# EasyEDA schematic Sha_ExtruderDriver-03.json
TITLE: Sheet_1; REV: 1.0; Date: 2024-12-03; Sheet: 1/1; Company: Your Company
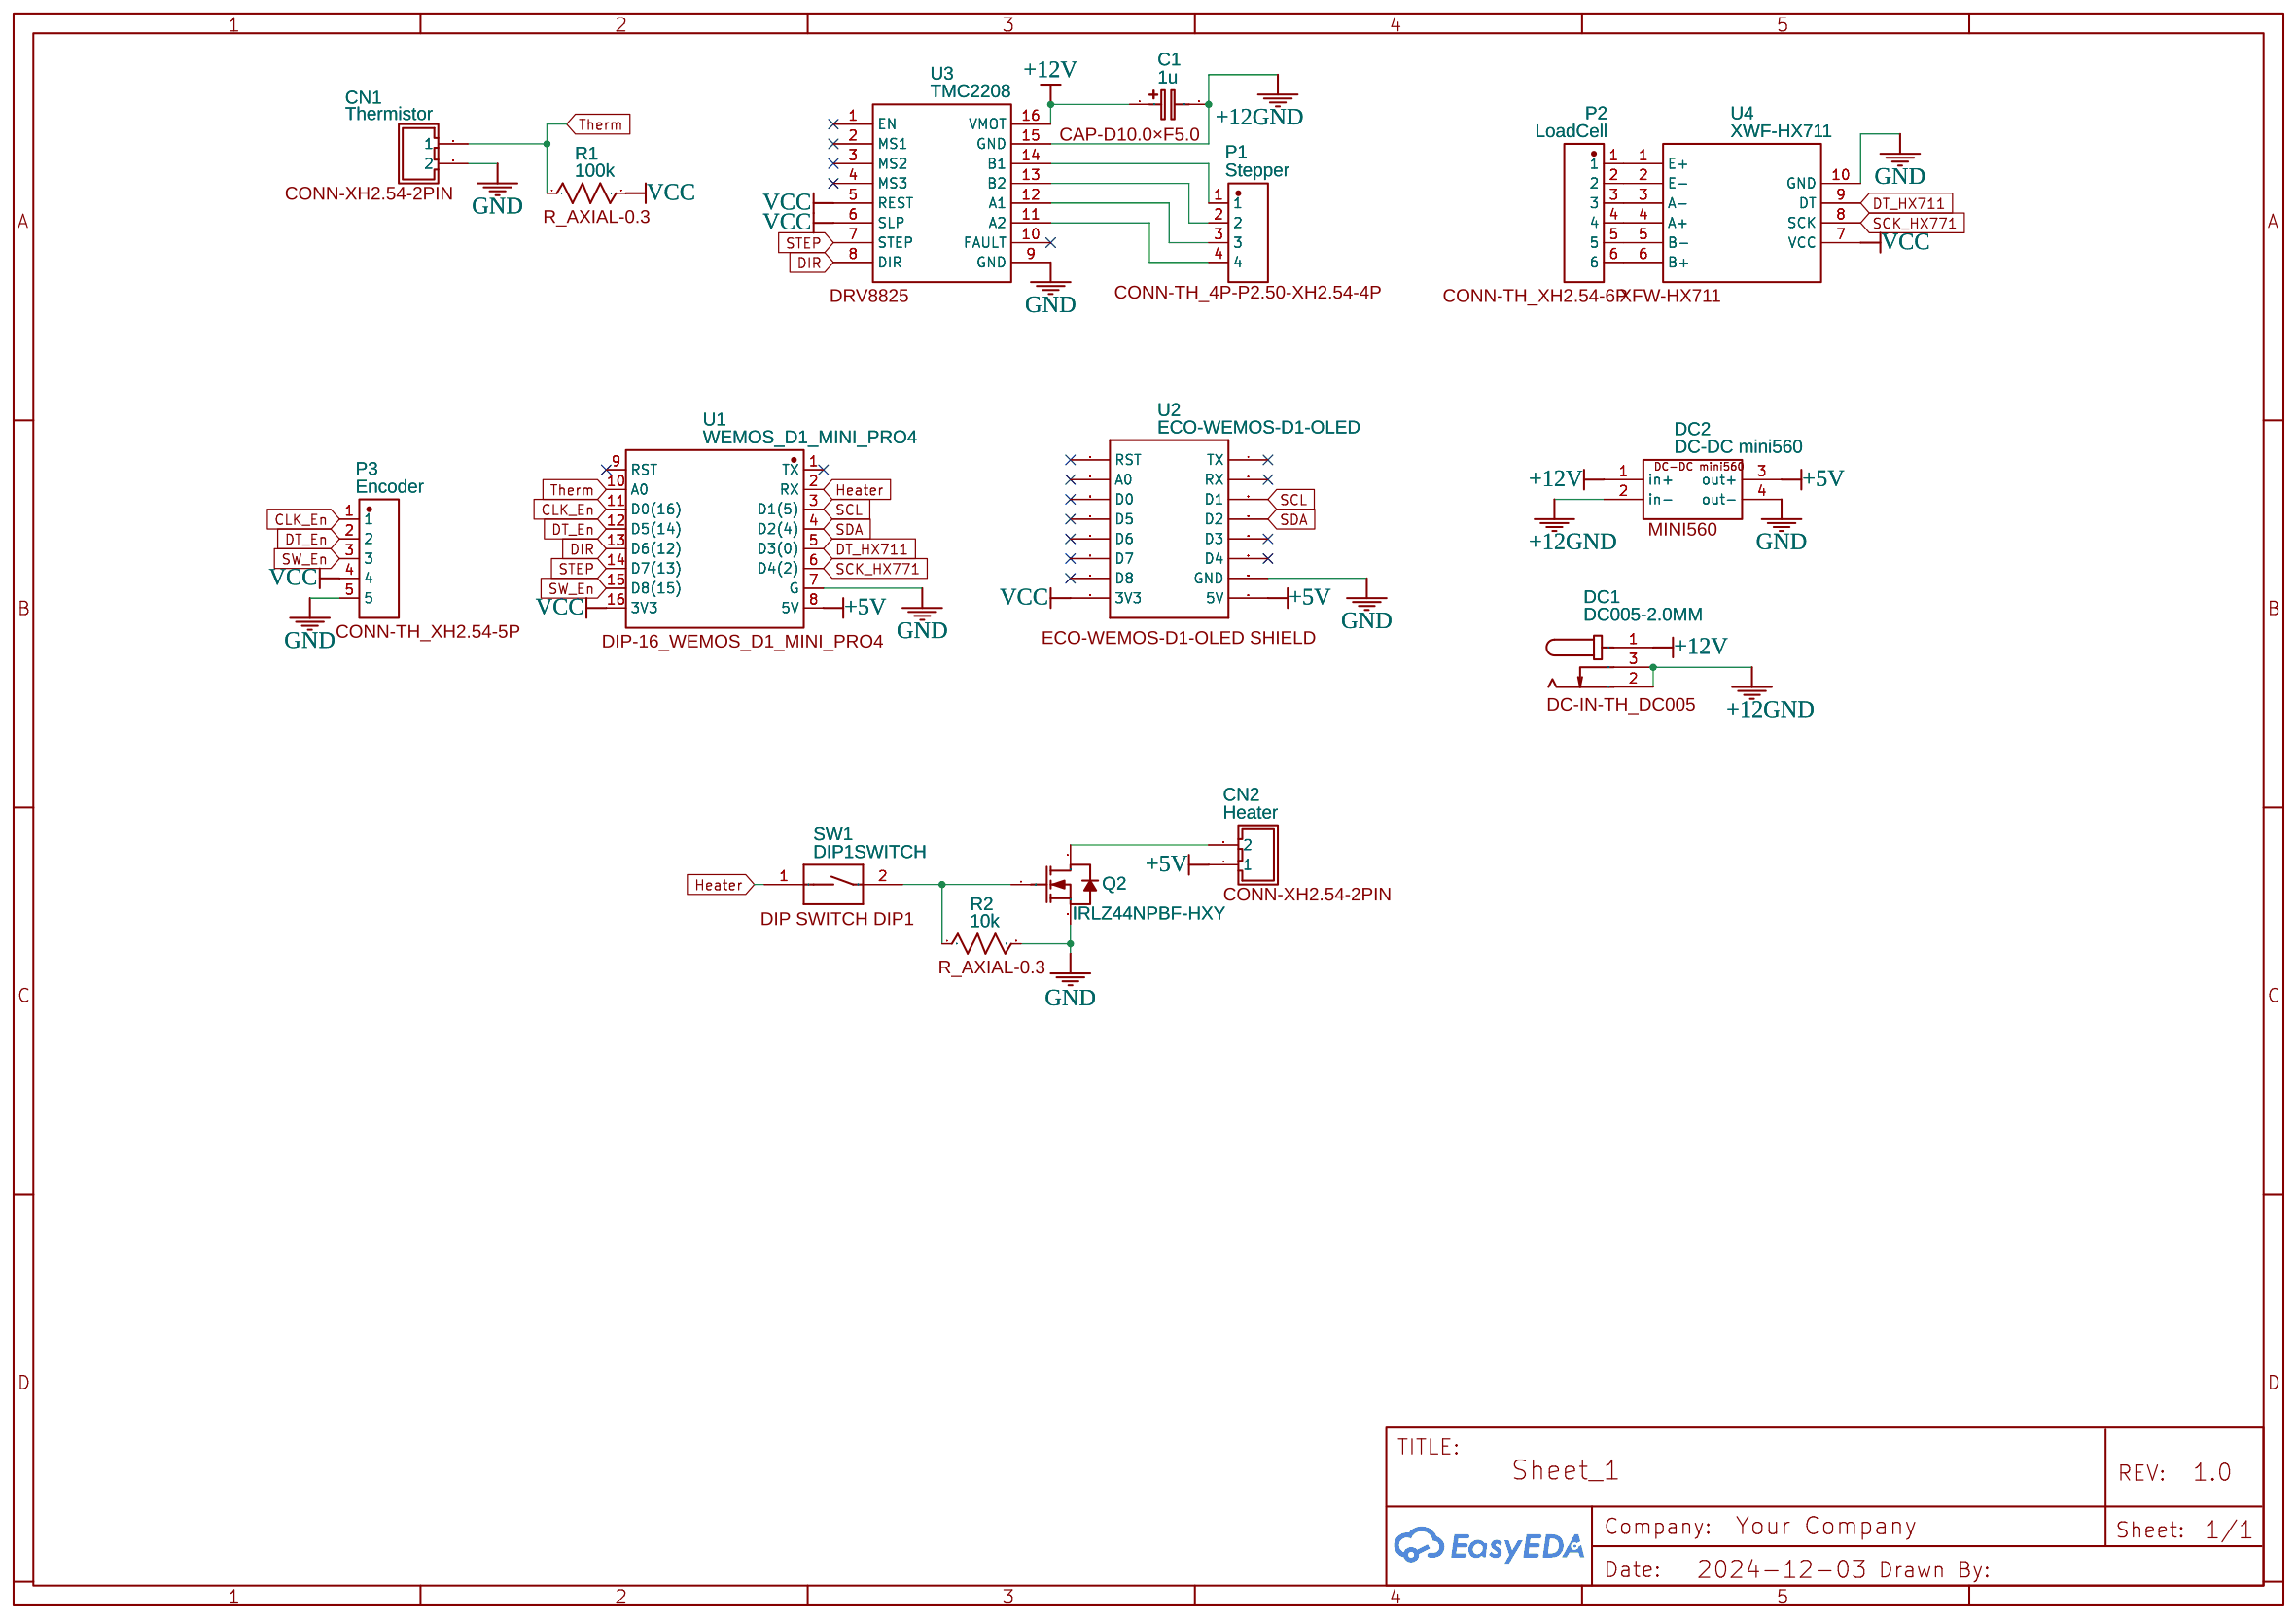
[diagram p0: schematic sheet]

## Parts
C1  1u  [CAP-D10.0×F5.0]
CN1  Thermistor  [CONN-XH2.54-2PIN]
CN2  Heater  [CONN-XH2.54-2PIN]
DC1  DC005-2.0MM  [DC-IN-TH_DC005]
DC2  DC-DC mini560  [MINI560]
P1  Stepper  [CONN-TH_4P-P2.50-XH2.54-4P]
P2  LoadCell  [CONN-TH_XH2.54-6P]
P3  Encoder  [CONN-TH_XH2.54-5P]
Q2  IRLZ44NPBF-HXY  [TO-220-3_L9.9-W4.5-P2.54-L-1]
R1  100k  [R_AXIAL-0.3]
R2  10k  [R_AXIAL-0.3]
SW1  DIP1SWITCH  [DIP SWITCH DIP1]
U1  WEMOS_D1_MINI_PRO4  [DIP-16_WEMOS_D1_MINI_PRO4]
U2  ECO-WEMOS-D1-OLED  [ECO-WEMOS-D1-OLED SHIELD]
U3  TMC2208  [DRV8825]
U4  XWF-HX711  [XFW-HX711]

## Library data of the parts
C1 = CE_TH_D10.0×F5.0_EU: Contributor: LCEDA_Lib; Package Display: Yes
CN1 CN2 = XH2.54-2PIN: Contributor: ahmedyerli; Package Display: Yes
DC1 = DC005-2.0MM: Supplier: LCSC; Manufacturer: SOFNG; Supplier Part: C111567; Package Display: Yes
DC2 = DC-DC mini560: Contributor: Ivan711; Package Display: Yes
P1 = XH-2.54-4P: Contributor: LCSC; Supplier: LCSC; Supplier Part: C9900003933; Manufacturer: null; Package Display: Yes
P2 = 02.XH2.54-6P: Contributor: LCSC; Supplier: LCSC; Supplier Part: C9900000754; Manufacturer: null; Manufacturer Part: XH2.54-6P 直插; JLCPCB Part Class: Extended Part; Package Display: Yes
P3 = XH_2.54_5P: Contributor: LCSC; Supplier: LCSC; Supplier Part: C9900004239; Manufacturer: null; JLCPCB Part Class: Extended Part; Package Display: Yes
Q2 = IRLZ44NPBF-HXY: Supplier: LCSC; Supplier Part: C22367197; Manufacturer: HXY MOSFET(华轩阳电子); JLCPCB Part Class: Extended Part; Contributor: lcsc; Package Display: No
R1 R2 = R_AXIAL-0.3_US: Contributor: LCEDA_Lib; Package Display: Yes
SW1 = DIP1SWITCH: Supplier: Digi-Key; Manufacturer: Omron Electronics Inc-EMC Div; Manufacturer Part: A6TN-1101; Supplier Part: Z12167-ND; Contributor: Willi_Billi; Package Display: Yes
U1 = WEMOS_D1_MINI_PRO4: Contributor: LCSC; Supplier: LCSC; Supplier Part: C2837266; Manufacturer: null; Manufacturer Part: Wemos_D1_mini_Pro4; JLCPCB Part Class: Extended Part; Package Display: Yes
U2 = ECO-WEMOS-D1-OLED: sourceId: YemgaslDx; Contributor: ecoenghk; Package Display: Yes
U3 = TMC2208: Contributor: Johanvd; Package Display: Yes
U4 = XWF-HX711: Contributor: C.M ABEYSINGHE; Package Display: Yes

## Nets
+5V: CN2.1 DC2.3(out+) U1.8(5V) U2.5V
+12V: C1.1 DC1.1 DC2.1(in+) U3.16(VMOT)
GND: CN1.2 DC2.4(out-) P3.5 Q2.3(S) R2.2 U1.7(G) U2.GND U3.9(GND) U4.10(GND)
VCC: P3.4 R1.2 U1.16(3V3) U2.3V3 U3.5(REST) U3.6(SLP) U4.7(VCC)
+12GND: C1.2 DC1.2 DC1.3 DC2.2(in-) U3.15(GND)
CLK_En: P3.1 U1.11(D0(16))
DIR: U1.13(D6(12)) U3.8(DIR)
DT_En: P3.2 U1.12(D5(14))
DT_HX711: U1.5(D3(0)) U4.9(DT)
Heater: SW1.1 U1.2(RX)
SCK_HX771: U1.6(D4(2)) U4.8(SCK)
SCL: U1.3(D1(5)) U2.D1
SDA: U1.4(D2(4)) U2.D2
STEP: U1.14(D7(13)) U3.7(STEP)
SW_En: P3.3 U1.15(D8(15))
Therm: CN1.1 R1.1 U1.10(A0)
Net-(CN2-2): CN2.2 Q2.2(D)
Net-(P1-1): P1.1 U3.14(B1)
Net-(P1-2): P1.2 U3.13(B2)
Net-(P1-3): P1.3 U3.12(A1)
Net-(P1-4): P1.4 U3.11(A2)
Net-(P2-1): P2.1 U4.1(E+)
Net-(P2-2): P2.2 U4.2(E-)
Net-(P2-3): P2.3 U4.3(A-)
Net-(P2-4): P2.4 U4.4(A+)
Net-(P2-5): P2.5 U4.5(B-)
Net-(P2-6): P2.6 U4.6(B+)
Net-(Q2-1): Q2.1(G) R2.1 SW1.2

Not connected (* = marked no-connect by the designer): U1 1(TX)* 9(RST)*; U2 A0* D0* D3* D4* D5* D6* D7* D8* RST* RX* TX*; U3 1(EN)* 2(MS1)* 3(MS2)* 4(MS3)* 10(FAULT)*
